# EasyEDA schematic 1-Schematic_onboard.json
TITLE: Touch Conductive Piano; REV: 1.0; Date: 2024-06-03; Sheet: 1/1; Drawn By: Lena Conde Araujo; Company: N/A
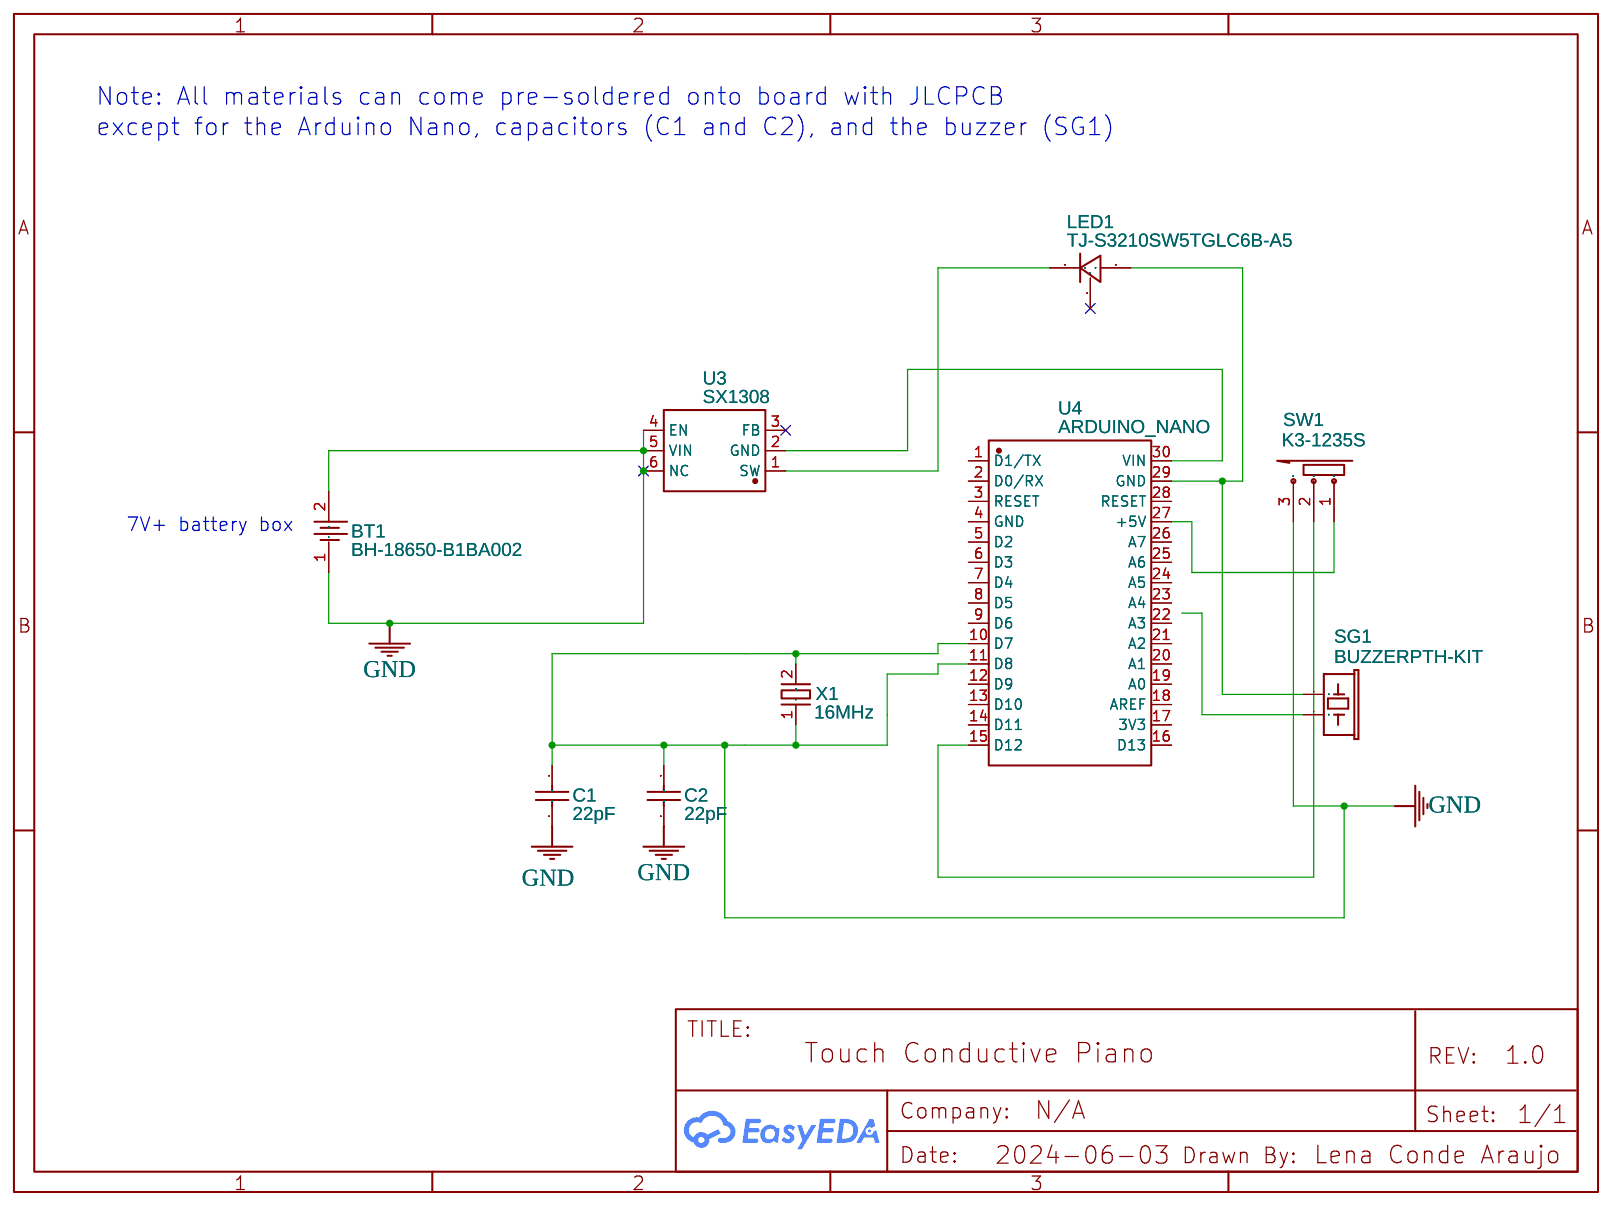
[diagram p0: schematic sheet]

## Parts
BT1  BH-18650-B1BA002  [BATTERY-SMD_18650-1S-L77.1-W20.7-1]
C1  22pF  [MURATA_22PF]
C2  22pF  [MURATA_22PF]
LED1  TJ-S3210SW5TGLC6B-A5  [LED-SMD_3P-L3.2-W1.0-RD]
SG1  BUZZERPTH-KIT  [BUZZER-12MM-KIT]
SW1  K3-1235S  [SW-SMD_K3-1235S-K1]
U3  SX1308  [SOT-23-6_L2.9-W1.6-P0.95-LS2.8-BL]
U4  ARDUINO_NANO  [COMM-TH_ARDUINO_NANO]
X1  16MHz  [HC-49US-TH_L7.0-W4.0-P4.00-D0.4]

## Library data of the parts
BT1 = BH-18650-B1BA002: Contributor: lcsc; Supplier: LCSC; Supplier Part: C2988620; Manufacturer: MYOUNG(美阳); JLCPCB Part Class: Extended Part
C1 C2 = COND_NONPOL_MKS_22uF: Contributor: atikahaat03
LED1 = TJ-S3210SW5TGLC6B-A5: Contributor: LCSC; Supplier: LCSC; Supplier Part: C273631; Manufacturer: TOGIALED(统佳); JLCPCB Part Class: Extended Part
SG1 = BUZZERPTH-KIT: Buzzer 12mm
SW1 = K3-1235S: Supplier: LCSC; Manufacturer: 韩国韩荣; Manufacturer Part: K3-1235S-F1; Supplier Part: C92660; JLCPCB Part Class: Extended Part
U3 = SX1308: sourceId: g4Yg9rJ1j; Supplier: LCSC; Manufacturer: SX(硕芯科技); Supplier Part: C78162; JLCPCB Part Class: Extended Part
U4 = ARDUINO_NANO: Contributor: lcsc; Supplier: LCSC; Supplier Part: C9900017879; Manufacturer: null; JLCPCB Part Class: Extended Part
X1 = KMS160001210: Supplier: LCSC; Supplier Part: C18209178; Manufacturer: KYX(凯越翔); Contributor: lcsc

## Nets
GND: BT1.1 BT1.2 C1.1 C1.2 C2.1 C2.2 SW1.3 U3.4(EN) U3.5(VIN) U3.6(NC) U4.10(D7) U4.11(D8) X1.1 X1.2(GND)
Net-(LED1-1): LED1.1 U3.1(SW)
Net-(LED1-2): LED1.2 SG1.+(1) U4.29(GND)
Net-(SW1-1): SW1.1 U4.27(+5V)
Net-(SW1-2): SW1.2 U4.15(D12)
Net-(U3-2): U3.2(GND) U4.30(VIN)

Not connected (* = marked no-connect by the designer): LED1 3*; SG1 -(2); U3 3(FB)*; U4 1(D1/TX) 2(D0/RX) 3(RESET) 4(GND) 5(D2) 6(D3) 7(D4) 8(D5) 9(D6) 12(D9) 13(D10) 14(D11) 16(D13) 17(3V3) 18(AREF) 19(A0) 20(A1) 21(A2) 22(A3) 23(A4) 24(A5) 25(A6) 26(A7) 28(RESET)

## Notes on the sheet
- Note: All materials can come pre-soldered onto board with JLCPCB
- except for the Arduino Nano, capacitors (C1 and C2), and the buzzer (SG1)
- 7V+ battery box
